# EAGLE design board (EAGLE 9.1.2)
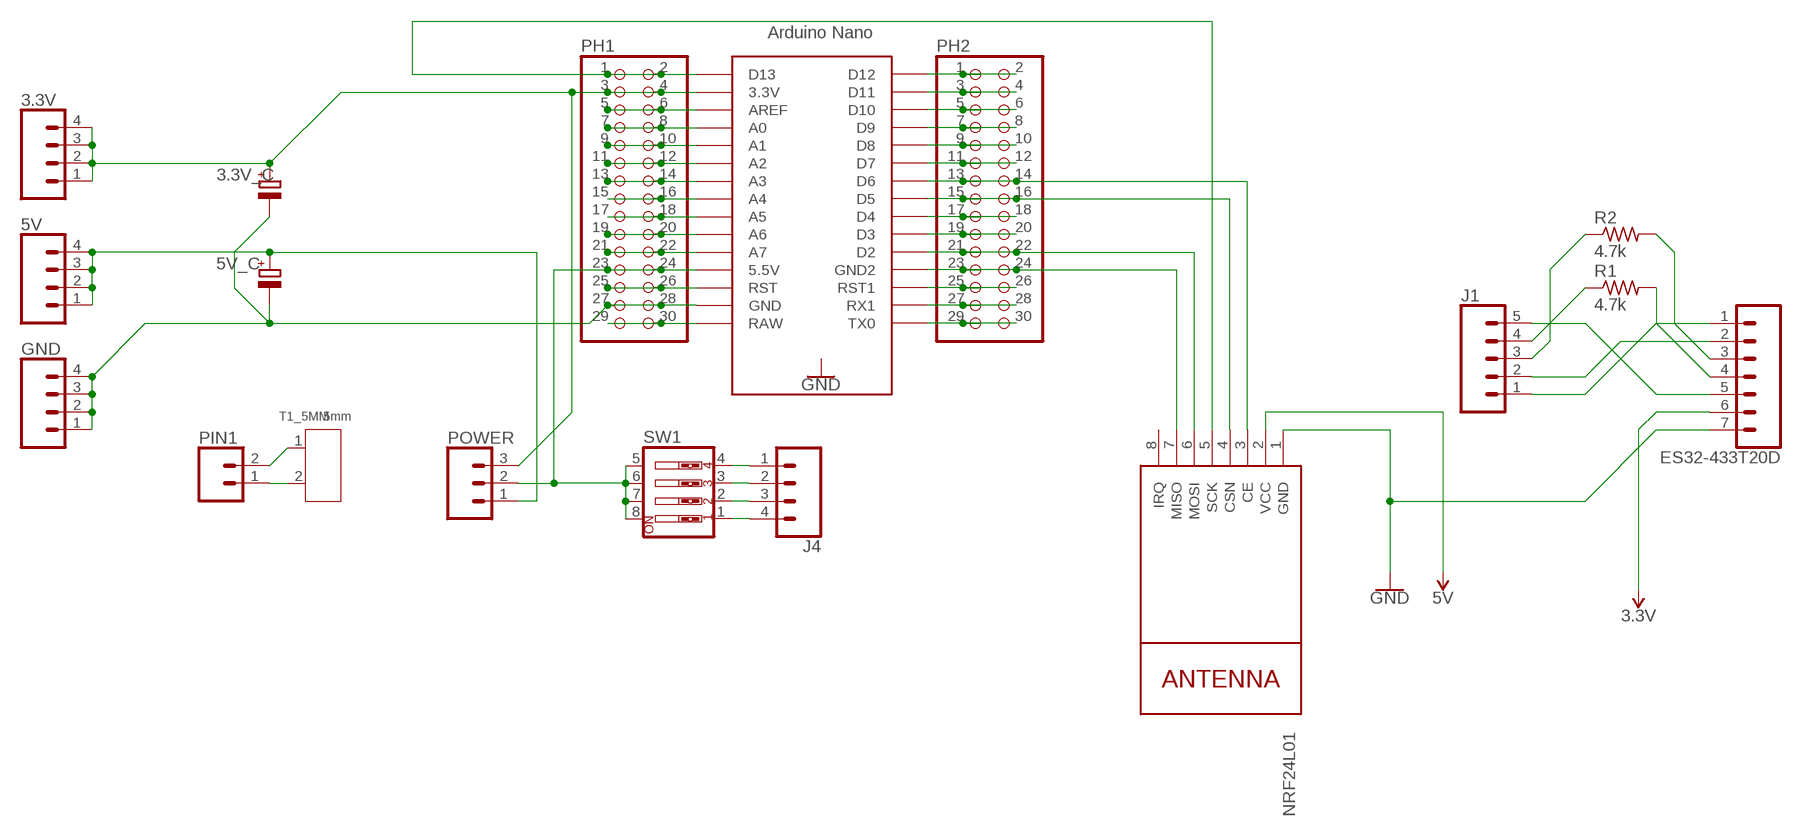
[diagram p0: schematic, sheet 1]

## Parts
3.3V  CONN_04LOCK  [1X04_LOCK]
3.3V_C  CPOL-EUD  [PANASONIC_D]
5V  CONN_04LOCK  [1X04_LOCK]
5V_C  CPOL-EUD  [PANASONIC_D]
ES32-433T20D  CONN_07LOCK  [1X07_LOCK]
GND  CONN_04LOCK  [1X04_LOCK]
J1  CONN_05LOCK  [1X05_LOCK]
J4  CONN_04LOCK  [1X04_LOCK]
NANO  NANO  [NANO]
NRF24L01  WIRELESS-NRF24L01  [WIRELESS-NRF24L01]
PH1  PINHD-2X15  [2X15]
PH2  PINHD-2X15  [2X15]
PIN1  CONN_02LOCK  [1X02_LOCK]
POWER  CONN_03LOCK  [1X03_LOCK]
R1  4.7k  R-US_R2012  [R2012]
R2  4.7k  R-US_R2012  [R2012]
SW1  SW_DIP-4  [EDG-04]
T1_5MM  5mm  SCREW-TERMINAL-GREEN(2P-5.0)  [H2-5.0-10.5X8.0MM]

## Nets
3.3V [power]: 3.3V.1 3.3V.2 3.3V.3 3.3V.4 3.3V_C.+ ES32-433T20D.6 NANO.3.3V PH1.3 PH1.4 POWER.3
5V [power]: 5V.1 5V.2 5V.3 5V.4 5V_C.+ NRF24L01.2(VCC) POWER.1
A5: NANO.A5 PH1.17 PH1.18
A6: NANO.A6 PH1.19 PH1.20
A7: NANO.A7 PH1.21 PH1.22
CE_NRF: NANO.D6 NRF24L01.3(CE) PH2.13 PH2.14
CSN_NRF: NANO.D5 NRF24L01.4(CSN) PH2.15 PH2.16
GND [power]: 3.3V_C.- 5V_C.- ES32-433T20D.7 GND.1 GND.2 GND.3 GND.4 NANO.GND NANO.ICSP6 NRF24L01.1(GND) PH1.27 PH1.28
MISO_NRF: NANO.GND1(GND2) NRF24L01.7(MISO) PH2.23 PH2.24
MOSI_NRF: NANO.D2 NRF24L01.6(MOSI) PH2.21 PH2.22
N$1: ES32-433T20D.2 J1.2
N$3: NANO.AREF PH1.5 PH1.6
N$4: NANO.A0 PH1.7 PH1.8
N$5: NANO.A1 PH1.9 PH1.10
N$6: NANO.A2 PH1.11 PH1.12
N$7: NANO.A3 PH1.13 PH1.14
N$12: ES32-433T20D.1 J1.1
N$13: J1.4 R1.1
N$14: J1.3 R2.1
N$15: ES32-433T20D.4 R1.2
N$16: NANO.D12 PH2.1 PH2.2
N$17: NANO.D11 PH2.3 PH2.4
N$18: NANO.D10 PH2.5 PH2.6
N$19: NANO.D9 PH2.7 PH2.8
N$20: NANO.D8 PH2.9 PH2.10
N$21: NANO.D7 PH2.11 PH2.12
N$22: ES32-433T20D.5 J1.5
N$23 [terminal]: PIN1.2 T1_5MM.1
N$24: NANO.D4 PH2.17 PH2.18
N$25: NANO.D3 PH2.19 PH2.20
N$26 [terminal]: PIN1.1 T1_5MM.2
N$28: NANO.RST1 PH2.25 PH2.26
N$29: NANO.RX1 PH2.27 PH2.28
N$30: NANO.TX0 PH2.29 PH2.30
N$36 [power]: NANO.5V(5.5V) PH1.23 PH1.24 POWER.2 SW1.5 SW1.6 SW1.7 SW1.8
N$38: ES32-433T20D.3 R2.2
N$39 [power]: J4.1 SW1.4
N$40 [power]: J4.2 SW1.3
N$41 [power]: J4.3 SW1.2
N$42 [power]: J4.4 SW1.1
RST: NANO.RST PH1.25 PH1.26
SCK_NRF: NANO.D13 NRF24L01.5(SCK) PH1.1 PH1.2
SDA_GY521: NANO.A4 PH1.15 PH1.16
VIN [power]: NANO.RAW PH1.29 PH1.30
Unconnected: NANO.ICSP1 NANO.ICSP2 NANO.ICSP3 NANO.ICSP4 NANO.ICSP5 NRF24L01.8(IRQ)

## Library data of the parts
3.3V 5V GND J4 = SparkFun-Connectors:CONN_04: Multi connection point. Often used as Generic Header-pin footprint for 0.1 inch spaced/style header connections On any of the 0.1 inch spaced packages, you can populate with these: Break Away Headers - Straight <https://www.sparkfun.com/products/116> (PRT-00116) Break Away Male Headers - Right Angle <https://www.sparkfun.com/products/553> (PRT-00553) Female Headers <https://www.sparkfun.com/products/115> (PRT-00115) Break Away Headers - Machine Pin <https://www.sparkfun.com/products/117> (PRT-00117) Break Away Female Headers - Swiss Machine Pin <https://www.sparkfun.com/products/743> (PRT-00743) For SCREWTERMINALS and SPRING TERMINALS visit here: Screw Terimnals on SparkFun.com <https://www.sparkfun.com/search/results?term=Screw+Terminals> (5mm/3.5mm/2.54mm spacing) This device is also useful as a general connection point to wire up your design to another part of your project. Our various solder wires solder well into these plated through hole pads. Hook-Up Wire - Assortment (Stranded, 22 AWG) <https://www.sparkfun.com/products/11375> (PRT-11375) Hook-Up Wire - Assortment (Solid Core, 22 AWG) <https://www.sparkfun.com/products/11367> (PRT-11367) View the entire wire category on our website here <https://www.sparkfun.com/categories/141> Special notes: Molex polarized connector foot print use with SKU : PRT-08231 with associated crimp pins and housings. 1MM SMD Version SKU: PRT-10208; PROD_ID: CONN-09696
3.3V_C 5V_C = rcl:CPOL-EU: POLARIZED CAPACITOR, European symbol
ES32-433T20D = SparkFun-Connectors:CONN_07: Multi connection point. Often used as Generic Header-pin footprint for 0.1 inch spaced/style header connections On any of the 0.1 inch spaced packages, you can populate with these: Break Away Headers - Straight <https://www.sparkfun.com/products/116> (PRT-00116) Break Away Male Headers - Right Angle <https://www.sparkfun.com/products/553> (PRT-00553) Female Headers <https://www.sparkfun.com/products/115> (PRT-00115) Break Away Headers - Machine Pin <https://www.sparkfun.com/products/117> (PRT-00117) Break Away Female Headers - Swiss Machine Pin <https://www.sparkfun.com/products/743> (PRT-00743) For SCREWTERMINALS and SPRING TERMINALS visit here: Screw Terimnals on SparkFun.com <https://www.sparkfun.com/search/results?term=Screw+Terminals> (5mm/3.5mm/2.54mm spacing) This device is also useful as a general connection point to wire up your design to another part of your project. Our various solder wires solder well into these plated through hole pads. Hook-Up Wire - Assortment (Stranded, 22 AWG) <https://www.sparkfun.com/products/11375> (PRT-11375) Hook-Up Wire - Assortment (Solid Core, 22 AWG) <https://www.sparkfun.com/products/11367> (PRT-11367) View the entire wire category on our website here <https://www.sparkfun.com/categories/141> Special notes: Molex polarized connector foot print use with SKU : PRT-08231 with associated crimp pins and housings. 1MM SMD Version SKU: PRT-10208 NOTES ON THE VARIANTS LOCK and LOCK_LONGPADS... This footprint was designed to help hold the alignment of a through-hole component (i.e. 6-pin header) while soldering it into place. You may notice that each hole has been shifted either up or down by 0.005 of an inch from it's more standard position (which is a perfectly straight line). This slight alteration caused the pins (the squares in the middle) to touch the edges of the holes. Because they are alternating, it causes a "brace" to hold the component in place. 0.005 has proven to be the perfect amount of "off-center" position when using our standard breakaway headers. Although looks a little odd when you look at the bare footprint, once you have a header in there, the alteration is very hard to notice. Also,if you push a header all the way into place, it is covered up entirely on the bottom side.
J1 = SparkFun-Connectors:CONN_05: Multi connection point. Often used as Generic Header-pin footprint for 0.1 inch spaced/style header connections On any of the 0.1 inch spaced packages, you can populate with these: Break Away Headers - Straight <https://www.sparkfun.com/products/116> (PRT-00116) Break Away Male Headers - Right Angle <https://www.sparkfun.com/products/553> (PRT-00553) Female Headers <https://www.sparkfun.com/products/115> (PRT-00115) Break Away Headers - Machine Pin <https://www.sparkfun.com/products/117> (PRT-00117) Break Away Female Headers - Swiss Machine Pin <https://www.sparkfun.com/products/743> (PRT-00743) For SCREWTERMINALS and SPRING TERMINALS visit here: Screw Terimnals on SparkFun.com <https://www.sparkfun.com/search/results?term=Screw+Terminals> (5mm/3.5mm/2.54mm spacing) This device is also useful as a general connection point to wire up your design to another part of your project. Our various solder wires solder well into these plated through hole pads. Hook-Up Wire - Assortment (Stranded, 22 AWG) <https://www.sparkfun.com/products/11375> (PRT-11375) Hook-Up Wire - Assortment (Solid Core, 22 AWG) <https://www.sparkfun.com/products/11367> (PRT-11367) View the entire wire category on our website here <https://www.sparkfun.com/categories/141> Special notes: Molex polarized connector foot print use with SKU : PRT-08231 with associated crimp pins and housings. 1MM SMD Version SKU: PRT-10208
NANO = Arduino-clone:NANO: Arduino Nano
NRF24L01 = diy-modules:WIRELESS-NRF24L01: 2.4 GHz Wireless Module based on NRF24L01 chip More details available here: http://www.electrodragon.com/w/NRF24L01 Click here to find device on ebay.com <http://www.ebay.com/sch/nrf24l01+arduino>
PH1 PH2 = pinhead:PINHD-2X15: PIN HEADER
PIN1 = SparkFun-Connectors:CONN_02: Multi connection point. Often used as Generic Header-pin footprint for 0.1 inch spaced/style header connections On any of the 0.1 inch spaced packages, you can populate with these: Break Away Headers - Straight <https://www.sparkfun.com/products/116> (PRT-00116) Break Away Male Headers - Right Angle <https://www.sparkfun.com/products/553> (PRT-00553) Female Headers <https://www.sparkfun.com/products/115> (PRT-00115) Break Away Headers - Machine Pin <https://www.sparkfun.com/products/117> (PRT-00117) Break Away Female Headers - Swiss Machine Pin <https://www.sparkfun.com/products/743> (PRT-00743) For SCREWTERMINALS and SPRING TERMINALS visit here: Screw Terimnals on SparkFun.com <https://www.sparkfun.com/search/results?term=Screw+Terminals> (5mm/3.5mm/2.54mm spacing) This device is also useful as a general connection point to wire up your design to another part of your project. Our various solder wires solder well into these plated through hole pads. Hook-Up Wire - Assortment (Stranded, 22 AWG) <https://www.sparkfun.com/products/11375> (PRT-11375) Hook-Up Wire - Assortment (Solid Core, 22 AWG) <https://www.sparkfun.com/products/11367> (PRT-11367) View the entire wire category on our website here <https://www.sparkfun.com/categories/141> Special notes: Molex polarized connector foot print use with: PRT-08233 with associated crimp pins and housings. 2.54_SCREWTERM for use with PRT-10571. 3.5mm Screw Terminal footprints for PRT-08084 5mm Screw Terminal footprints for use with PRT-08432
POWER = SparkFun-Connectors:CONN_03: Multi connection point. Often used as Generic Header-pin footprint for 0.1 inch spaced/style header connections On any of the 0.1 inch spaced packages, you can populate with these: Break Away Headers - Straight <https://www.sparkfun.com/products/116> (PRT-00116) Break Away Male Headers - Right Angle <https://www.sparkfun.com/products/553> (PRT-00553) Female Headers <https://www.sparkfun.com/products/115> (PRT-00115) Break Away Headers - Machine Pin <https://www.sparkfun.com/products/117> (PRT-00117) Break Away Female Headers - Swiss Machine Pin <https://www.sparkfun.com/products/743> (PRT-00743) Stackable Header - 3 Pin (Female, 0.1") <https://www.sparkfun.com/products/13875> (PRT-13875) For SCREWTERMINALS and SPRING TERMINALS visit here: Screw Terimnals on SparkFun.com <https://www.sparkfun.com/search/results?term=Screw+Terminals> (5mm/3.5mm/2.54mm spacing) This device is also useful as a general connection point to wire up your design to another part of your project. Our various solder wires solder well into these plated through hole pads. Hook-Up Wire - Assortment (Stranded, 22 AWG) <https://www.sparkfun.com/products/11375> (PRT-11375) Hook-Up Wire - Assortment (Solid Core, 22 AWG) <https://www.sparkfun.com/products/11367> (PRT-11367) View the entire wire category on our website here <https://www.sparkfun.com/categories/141> Special notes: Molex polarized connector foot print use with SKU : PRT-08232 with associated crimp pins and housings.
R1 R2 = rcl:R-US_: RESISTOR, American symbol; SPICEPREFIX: R
SW1 = special:SW_DIP-4: DIP SWITCH
T1_5MM = Seeed-Connector:SCREW-TERMINAL-GREEN(2P-5.0): 320110031; VALUE: GREEN-2P-5.0

## Net classes
0 default: width 0.203 mm, drill 0.127 mm, clearance 0.152 mm
1 power: width 0.762 mm, clearance 0.254 mm
2 terminal: width 2.159 mm, clearance 0.305 mm

## Board
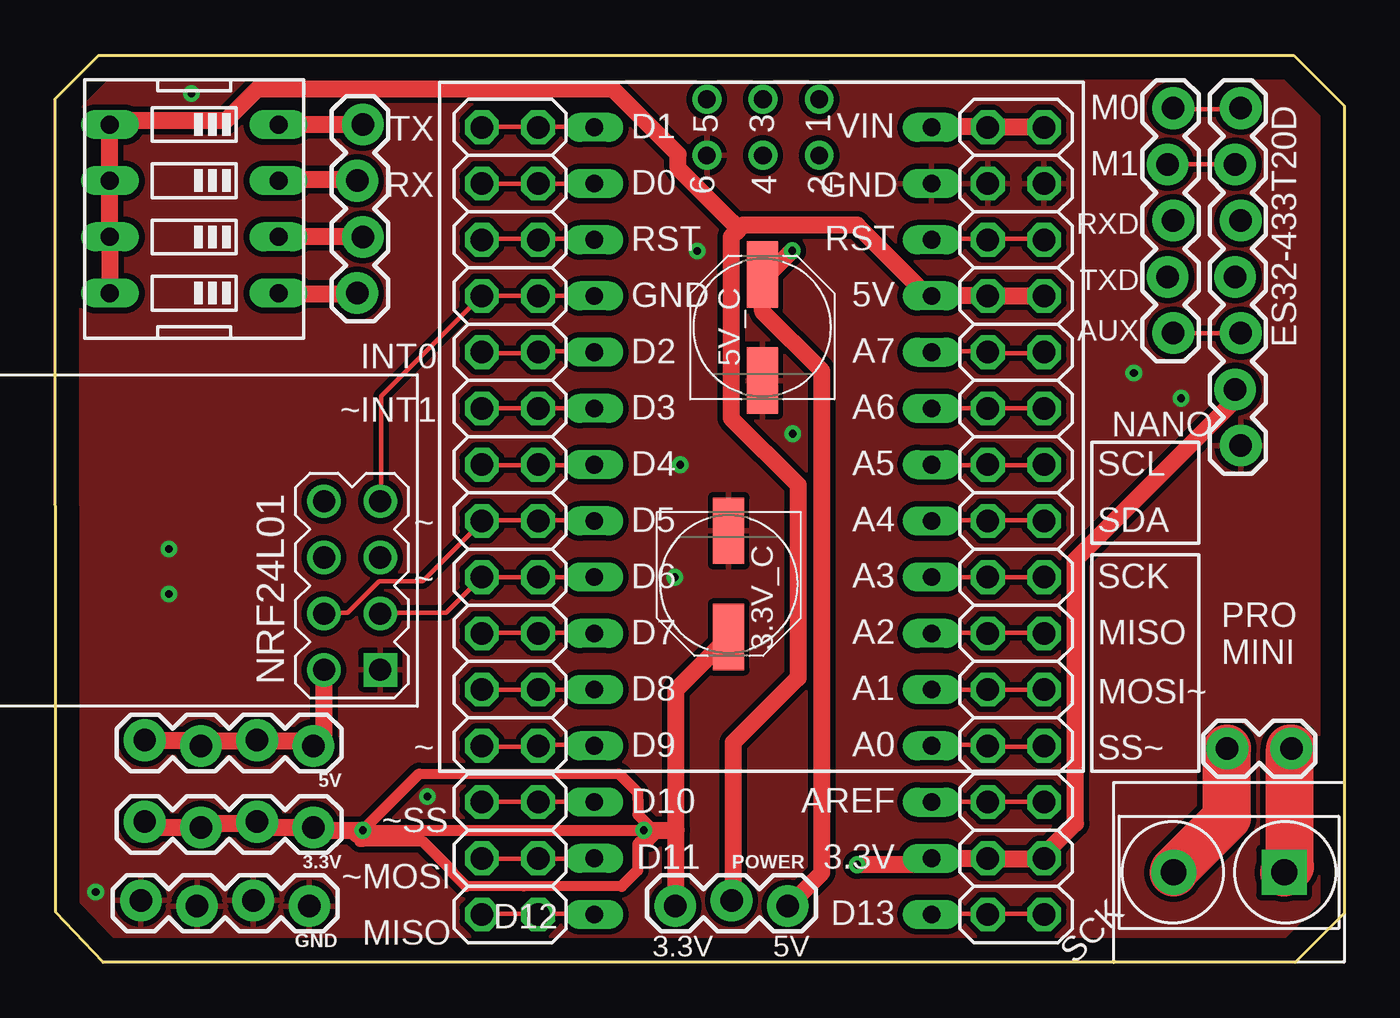
[diagram p1: board, top side]
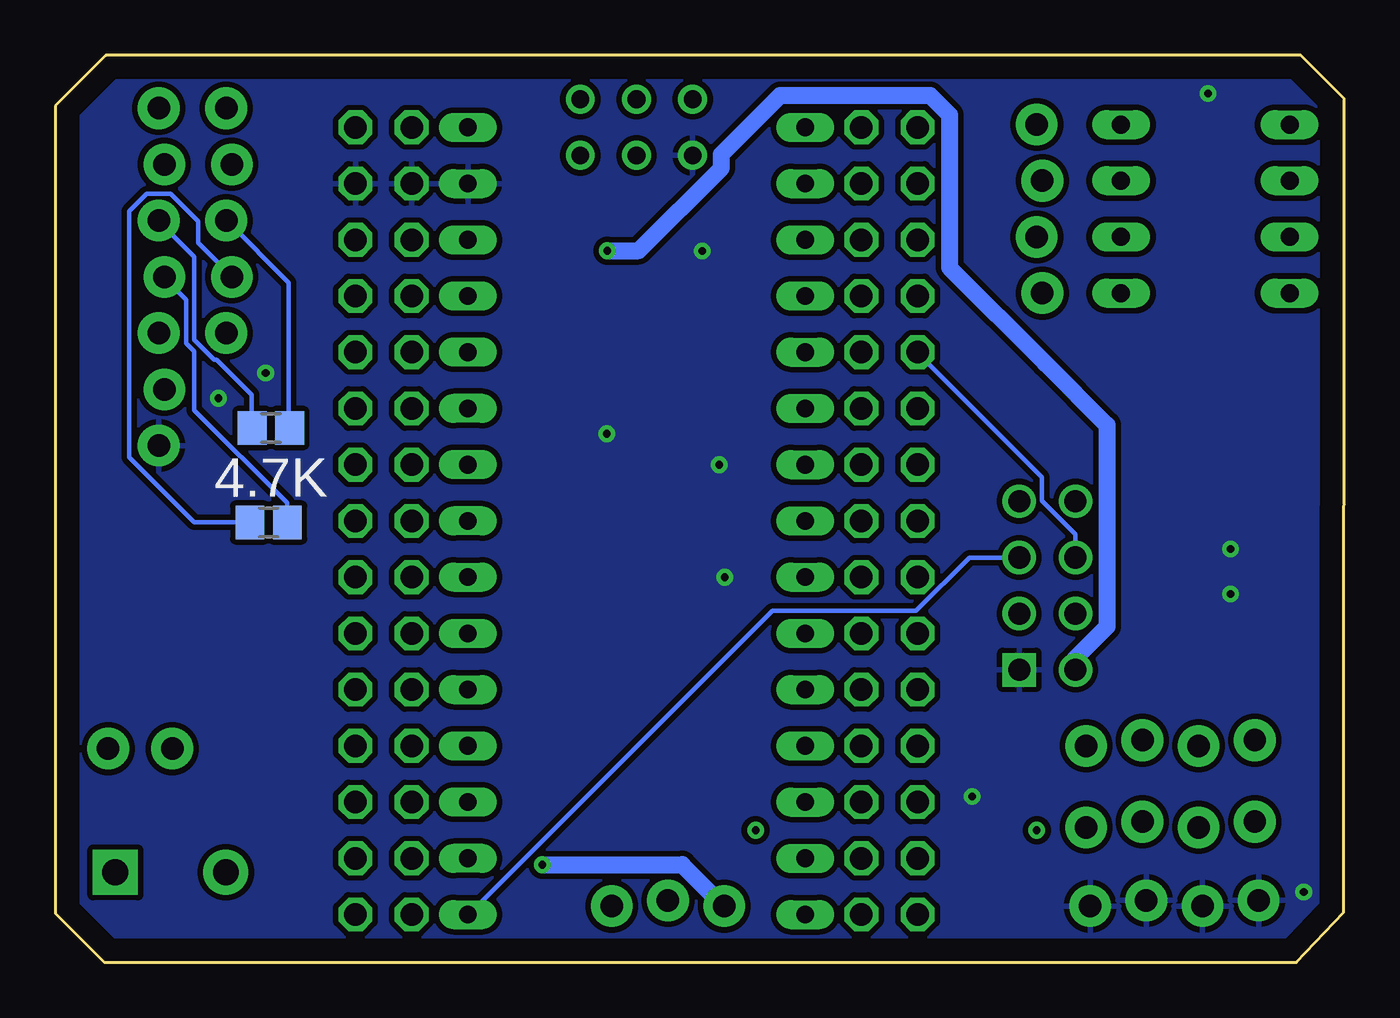
[diagram p2: board, bottom side, seen from below]

Size 58.24 x 40.97 mm. Coordinates in mm from the lower left corner, seen from the top.
Outline: 1.96,40.97 55.96,40.97 58.24,38.68 58.24,2.21 56.03,0 2.16,0 0.03,2.26 0,39.01 1.96,40.97
Copper layers (1*16): Top 0.035mm / dielectric 1.5mm / Bottom 0.035mm
Design rules "default": minimum track width 6mil, minimum drill 0.35mm, track to track 6mil, track to pad 6mil, pad to pad 6mil, via to via 6mil, smd to smd 6mil, copper to edge 40mil, drill to drill 6mil, minimum pad ring 10mil, minimum via ring 8mil, stop-mask expansion 4mil, vias tented up to drill 0mil, thermal gap 10mil

### Footprints (pad centres in the part's own frame; a part is rotated, then mirrored left to right if it is on the bottom)
1X04_LOCK = drill 1.016 pad 1.88: 1 0,0.127; 2 2.54,-0.127; 3 5.08,0.127; 4 7.62,-0.127
PANASONIC_D = smd 3 x 1.4: + 2.4,0; - -2.4,0
1X07_LOCK = drill 1.016 pad 1.88: 1 0,0.127; 2 2.54,-0.127; 3 5.08,0.127; 4 7.62,-0.127; 5 10.16,0.127; 6 12.7,-0.127; 7 15.24,0.127
1X05_LOCK = drill 1.016 pad 1.88: 1 0,0.127; 2 2.54,-0.127; 3 5.08,0.127; 4 7.62,-0.127; 5 10.16,0.127
NANO = drill 0.8 long: 3.3V -10.16,24.13; 5V -10.16,-1.27; A0 -10.16,19.05; A1 -10.16,16.51; A2 -10.16,13.97; A3 -10.16,11.43; A4 -10.16,8.89; A5 -10.16,6.35; A6 -10.16,3.81; A7 -10.16,1.27; AREF -10.16,21.59; D2 5.08,1.27; D3 5.08,3.81; D4 5.08,6.35; D5 5.08,8.89; D6 5.08,11.43; D7 5.08,13.97; D8 5.08,16.51; D9 5.08,19.05; D10 5.08,21.59; D11 5.08,24.13; D12 5.08,26.67; D13 -10.16,26.67; GND -10.16,-6.35; GND1 5.08,-1.27; RAW -10.16,-8.89; RST -10.16,-3.81; RST1 5.08,-3.81; RX1 5.08,-6.35; TX0 5.08,-8.89 | drill 0.8: ICSP1 -5.08,-10.16; ICSP2 -5.08,-7.62; ICSP3 -2.54,-10.16; ICSP4 -2.54,-7.62; ICSP5 0,-10.16; ICSP6 0,-7.62
WIRELESS-NRF24L01 = drill 1 square: 1 -12.7,6.35 | drill 1: 2 -10.16,6.35; 3 -12.7,3.81; 4 -10.16,3.81; 5 -12.7,1.27; 6 -10.16,1.27; 7 -12.7,-1.27; 8 -10.16,-1.27
2X15 = drill 1.016 octagon: 1 -17.78,-1.27; 2 -17.78,1.27; 3 -15.24,-1.27; 4 -15.24,1.27; 5 -12.7,-1.27; 6 -12.7,1.27; 7 -10.16,-1.27; 8 -10.16,1.27; 9 -7.62,-1.27; 10 -7.62,1.27; 11 -5.08,-1.27; 12 -5.08,1.27; 13 -2.54,-1.27; 14 -2.54,1.27; 15 0,-1.27; 16 0,1.27; 17 2.54,-1.27; 18 2.54,1.27; 19 5.08,-1.27; 20 5.08,1.27; 21 7.62,-1.27; 22 7.62,1.27; 23 10.16,-1.27; 24 10.16,1.27; 25 12.7,-1.27; 26 12.7,1.27; 27 15.24,-1.27; 28 15.24,1.27; 29 17.78,-1.27; 30 17.78,1.27
1X02_LOCK = drill 1.016 pad 1.88: 1 -0.178,0; 2 2.718,0
1X03_LOCK = drill 1.016 pad 1.88: 1 0,0.127; 2 2.54,-0.127; 3 5.08,0.127
R2012 = smd 1.3 x 1.5: 1 -0.85,0; 2 0.85,0
EDG-04 = drill 0.813 long: 1 -3.81,-3.81; 2 -1.27,-3.81; 3 1.27,-3.81; 4 3.81,-3.81; 5 3.81,3.81; 6 1.27,3.81; 7 -1.27,3.81; 8 -3.81,3.81
H2-5.0-10.5X8.0MM = drill 1.168 pad 2.032 square: 1 0,2.5 | drill 1.168 pad 2.032: 2 0,-2.5

### Placement (x,y rotation side)
3.3V  11.66,6.22 180 top
3.3V_C  30.43,17.09 270 top
5V  11.66,9.91 180 top
5V_C  31.95,28.68 90 top
ES32-433T20D  53.44,38.58 270 top
GND  11.48,2.67 180 top
J1  50.39,38.58 270 top
J4  13.77,37.85 270 top
NANO  29.44,28.83 180 top
NRF24L01  1.98,19.56 180 top
PH1  43.41,19.94 90 top
PH2  20.55,19.94 90 top
PIN1  53.14,9.65 0 top
POWER  33.1,2.67 180 top
R1  48.6,19.87 0 bottom
R2  48.5,24.14 180 bottom
SW1  6.27,34.04 90 top
T1_5MM  53.04,4.06 270 top

### Tracks (layer width: path | path; a pad name or v marks a point on that pad's centre or on a via)
3.3V  (via drill 0.35)
  Top 0.457: 16.44,8.52 25.47,8.52 | 25.59,3.43 21.16,3.43 18.57,3.43
  Top 0.508: v26.59,5.97 v13.89,5.97 16.44,8.52 | 25.47,8.52 26.31,7.68 26.31,7.38 26.32,7.37 26.32,6.67 27.18,5.82 26.83,5.48 26.45,5.48 26.31,5.34 26.31,4.15 25.59,3.43 | 18.57,3.43 17.91,4.08 17.91,4.15 16.6,5.46 13.89,5.46 13.77,5.46 13.51,5.71
  Top 0.762: 3.3V.4 4.05,6.27 4.23,6.1 6.54,6.1 3.3V.3 6.9,6.27 9.12,6.27 3.3V.2 9.47,6.1 11.61,6.1 3.3V.1 11.79,5.97 v13.89,5.97 | 28.05,5.97 28.05,2.54 POWER.3 | ES32-433T20D.6 53.3,25.83 53.3,25.39 46.1,18.19 46.1,6.27 44.86,5.03 PH1.3 44.68,4.67 42.46,4.67 PH1.4 42.1,4.67 39.61,4.67 NANO.3.3V 39.34,4.41 v36.23,4.41 | v26.59,5.97 28.05,5.97 | 28.05,5.97 28.05,12.32 3.3V_C.+
  Bottom 0.762: v36.23,4.41 29.92,4.41 28.05,2.54 POWER.3
5V  (via drill 0.35)
  Top 0.762: NRF24L01.2 12.14,10.27 11.7,9.83 5V.1 11.34,10.01 9.47,10.01 5V.2 9.12,10.01 6.9,10.01 5V.3 6.54,9.83 6.36,10.01 4.05,10.01 5V.4 | POWER.1 33.12,2.54 34.63,4.05 34.63,26.72 31.97,29.39 31.97,30.99 5V_C.+ 32.32,31.17 v33.3,32.14
  Bottom 0.762: NRF24L01.2 12.14,13.74 10.72,15.16 10.72,24.27 13.51,27.06 17.83,31.38 17.83,38.28 18.72,39.17 25.48,39.17 28.14,36.5 28.14,35.88 31.88,32.14 v33.3,32.14
A5
  Top 0.203: NANO.A5 39.61,22.45 42.1,22.45 PH1.18 42.19,22.45 44.68,22.45 PH1.17
A6
  Top 0.203: NANO.A6 42.1,25.03 PH1.20 42.19,25.03 PH1.19
A7
  Top 0.203: NANO.A7 39.61,27.61 42.1,27.61 PH1.22 42.19,27.52 44.68,27.52 PH1.21
CE_NRF
  Top 0.203: NANO.D6 24.32,17.39 21.83,17.39 PH2.13 21.74,17.39 19.34,17.39 PH2.14 19.25,17.39 17.65,15.79 14.72,15.79 NRF24L01.3
CSN_NRF
  Top 0.203: NANO.D5 24.32,19.96 21.83,19.96 PH2.15 21.74,19.96 19.34,19.96 PH2.16 19.25,19.88 16.59,17.21 14.63,17.21 13.21,15.79 12.14,15.79 NRF24L01.4
GND  (via drill 0.35)
  other vias: 33.32,23.88 16.81,7.49 6.15,39.24 48.73,26.62 50.87,25.48 29.01,32.13 5.13,18.67 5.13,16.64 1.83,3.17 27.99,17.4 28.24,22.48
  pour Top: 0.18,42.9 0.18,-0.13 60.25,-0.13 60.25,42.9
  pour Bottom: 0.05,99.7 0.05,-0.25 93.27,-0.25 93.27,99.7 0.05,99.82
MISO_NRF
  Top 0.203: NANO.GND1 24.32,30.1 PH2.23 21.74,30.1 19.34,30.1 PH2.24 19.25,30.1 14.72,25.57 14.72,20.85 NRF24L01.7
MOSI_NRF
  Top 0.203: NANO.D2 24.32,27.61 21.83,27.61 PH2.21 21.74,27.52 19.34,27.52 PH2.22
  Bottom 0.203: NRF24L01.6 12.14,18.36 12.14,19.34 13.65,20.85 13.65,21.92 19.25,27.52 PH2.22
N$1
  Top 0.203: J1.2 50.28,36.05 53.3,36.05 ES32-433T20D.2
N$3
  Top 0.203: NANO.AREF 42.1,7.25 PH1.6 42.19,7.25 PH1.5
N$4
  Top 0.203: NANO.A0 39.61,9.83 42.1,9.83 PH1.8 42.19,9.74 44.68,9.74 PH1.7
N$5
  Top 0.203: NANO.A1 42.1,12.32 PH1.10 42.19,12.32 PH1.9
N$6
  Top 0.203: NANO.A2 39.61,14.9 42.1,14.9 PH1.12 42.19,14.9 44.68,14.9 PH1.11
N$7
  Top 0.203: NANO.A3 39.61,17.39 42.1,17.39 PH1.14 42.19,17.39 44.68,17.39 PH1.13
N$12
  Top 0.203: J1.1 50.55,38.54 53.57,38.54 ES32-433T20D.1
N$13
  Bottom 0.203: R1.1 49.47,19.87 51.96,19.87 54.9,22.81 54.9,33.92 54.1,34.72 53.03,34.72 51.79,33.48 51.79,32.5 50.28,30.99 J1.4
N$14
  Bottom 0.203: R2.1 47.69,24.14 47.69,30.71 50.46,33.48 J1.3
N$15
  Bottom 0.203: R1.2 47.78,19.87 47.78,20.76 51.97,24.95 51.97,27.61 52.32,27.96 52.32,29.92 53.3,30.9 ES32-433T20D.4
N$16
  Top 0.203: NANO.D12 24.32,2.18 21.83,2.18 PH2.1 21.74,2.18 19.34,2.18 PH2.2
N$17
  Top 0.203: NANO.D11 24.32,4.67 21.83,4.67 PH2.3 21.74,4.67 19.34,4.67 PH2.4
N$18
  Top 0.203: NANO.D10 24.32,7.25 PH2.5 21.74,7.25 19.34,7.25 PH2.6
N$19
  Top 0.203: NANO.D9 24.32,9.83 21.83,9.83 PH2.7 21.74,9.74 19.34,9.74 PH2.8
N$20
  Top 0.203: NANO.D8 24.32,12.32 PH2.9 21.74,12.32 19.34,12.32 PH2.10
N$21
  Top 0.203: NANO.D7 24.32,14.9 21.83,14.9 PH2.11 21.74,14.9 19.34,14.9 PH2.12
N$22
  Top 0.203: J1.5 50.55,28.41 53.57,28.41 ES32-433T20D.5
N$23
  Top 2.159: PIN1.2 55.79,9.65 55.79,4.32 55.61,4.14 T1_5MM.1
N$24
  Top 0.203: NANO.D4 24.32,22.45 21.83,22.45 PH2.17 21.74,22.45 19.34,22.45 PH2.18
N$25
  Top 0.203: NANO.D3 24.32,25.03 PH2.19 21.74,25.03 19.34,25.03 PH2.20
N$26
  Top 2.159: PIN1.1 52.95,9.65 52.95,6.54 50.55,4.14 T1_5MM.2
N$28
  Top 0.203: NANO.RST1 24.32,32.68 21.83,32.68 PH2.25 21.74,32.68 19.34,32.68 PH2.26
N$29
  Top 0.203: NANO.RX1 24.32,35.17 21.83,35.17 PH2.27 21.74,35.17 19.34,35.17 PH2.28
N$30
  Top 0.203: NANO.TX0 24.32,37.74 21.83,37.74 PH2.29 21.74,37.74 19.34,37.74 PH2.30
N$36
  Top 0.762: SW1.8 2.45,30.28 SW1.7 2.45,33.12 2.45,35.25 SW1.6 2.45,35.7 SW1.5 2.81,38.01 7.7,38.01 9.12,39.43 25.21,39.43 28.14,36.5 28.14,35.88 30.63,33.39 30.9,33.12 | PH1.23 42.46,30.1 PH1.24 42.1,30.1 NANO.5V 39.26,30.28 36.23,33.3 31.08,33.3 30.9,33.12 | 30.9,33.12 30.54,32.77 30.54,24.59 33.57,21.57 33.57,12.85 30.63,9.92 30.63,2.81 POWER.2
N$38
  Bottom 0.203: R2.2 49.38,24.14 49.38,25.65 50.94,27.21 51.06,27.21 51.97,28.12 51.97,31.88 53.57,33.48 ES32-433T20D.3
N$39
  Top 0.762: SW1.4 10.1,37.83 13.83,37.83 J4.1
N$40
  Top 0.762: SW1.3 10.1,35.34 13.56,35.34 J4.2
N$41
  Top 0.762: SW1.2 10.1,32.77 13.83,32.77 J4.3
N$42
  Top 0.762: SW1.1 10.1,30.19 13.56,30.19 J4.4
RST
  Top 0.203: NANO.RST 39.61,32.68 42.1,32.68 PH1.26 42.19,32.68 44.68,32.68 PH1.25
SCK_NRF
  Top 0.203: NANO.D13 39.61,2.18 42.1,2.18 PH1.2 42.19,2.18 44.68,2.18 PH1.1
  Bottom 0.203: NRF24L01.5 14.72,18.28 16.94,18.28 19.34,15.87 25.83,15.87 39.52,2.18 NANO.D13
SDA_GY521
  Top 0.203: NANO.A4 39.61,19.96 42.1,19.96 PH1.16 42.19,19.96 44.68,19.96 PH1.15
VIN
  Top 0.762: NANO.RAW 39.61,37.74 42.1,37.74 PH1.30 42.46,37.74 44.68,37.74 PH1.29

### Text on the board
tPlace: M0 | TX | 5 | 3 | 1 | VIN | D1 | M1 | RX | 6 | 4 | 2 | GND | D0 | RXD | RST | RST | 5V | TXD | GND | AUX | INT0 | A7 | D2 | ~INT1 | A6 | D3 | NANO | A5 | D4 | SCL | ~ | A4 | D5 | SDA | ~ | A3 | D6 | SCK | A2 | PRO / MINI | D7 | MISO | A1 | D8 | MOSI~ | A0 | ~ | D9 | SS~ | AREF | ~SS | D10 | ~MOSI | 3.3V | D11 | D13 | MISO | D12 | 3.3V | 5V | SCK
bPlace: 4.7K
silktop: TOP
silkbottom: BOT